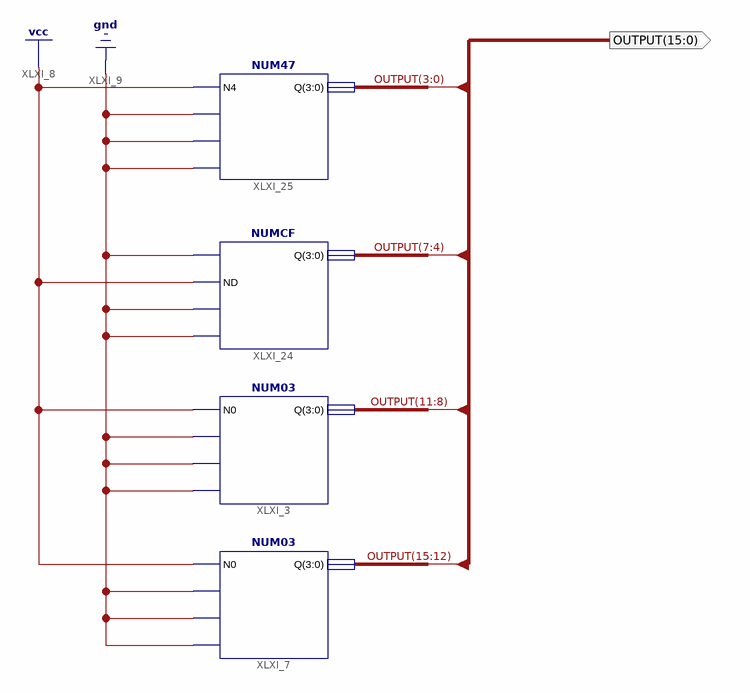
[diagram p0: schematic sheet 1]
// Xilinx ISE schematic BIN212.sch (spartan6) as structural Verilog: 4 symbols, 1 ports
module BIN212 (
  output [15:0] OUTPUT
);

  NUM03 XLXI_3 (.N2(1'b0), .N3(1'b0), .N0(1'b1), .N1(1'b0), .Q(OUTPUT[11:8]));
  NUM03 XLXI_7 (.N2(1'b0), .N3(1'b0), .N0(1'b1), .N1(1'b0), .Q(OUTPUT[15:12]));
  NUMCF XLXI_24 (.NE(1'b0), .NF(1'b0), .NC(1'b0), .ND(1'b1), .Q(OUTPUT[7:4]));
  NUM47 XLXI_25 (.Q(OUTPUT[3:0]), .N5(1'b0), .N4(1'b1), .N6(1'b0), .N7(1'b0));
endmodule
